# EasyEDA schematic SCH_G-Cacher_2026-07-06.json
TITLE: G-Cacher Esp32S3; REV: 0; Date: 2026-07-07; Sheet: 1/1; Drawn By: Niki Mardari; Company: ME
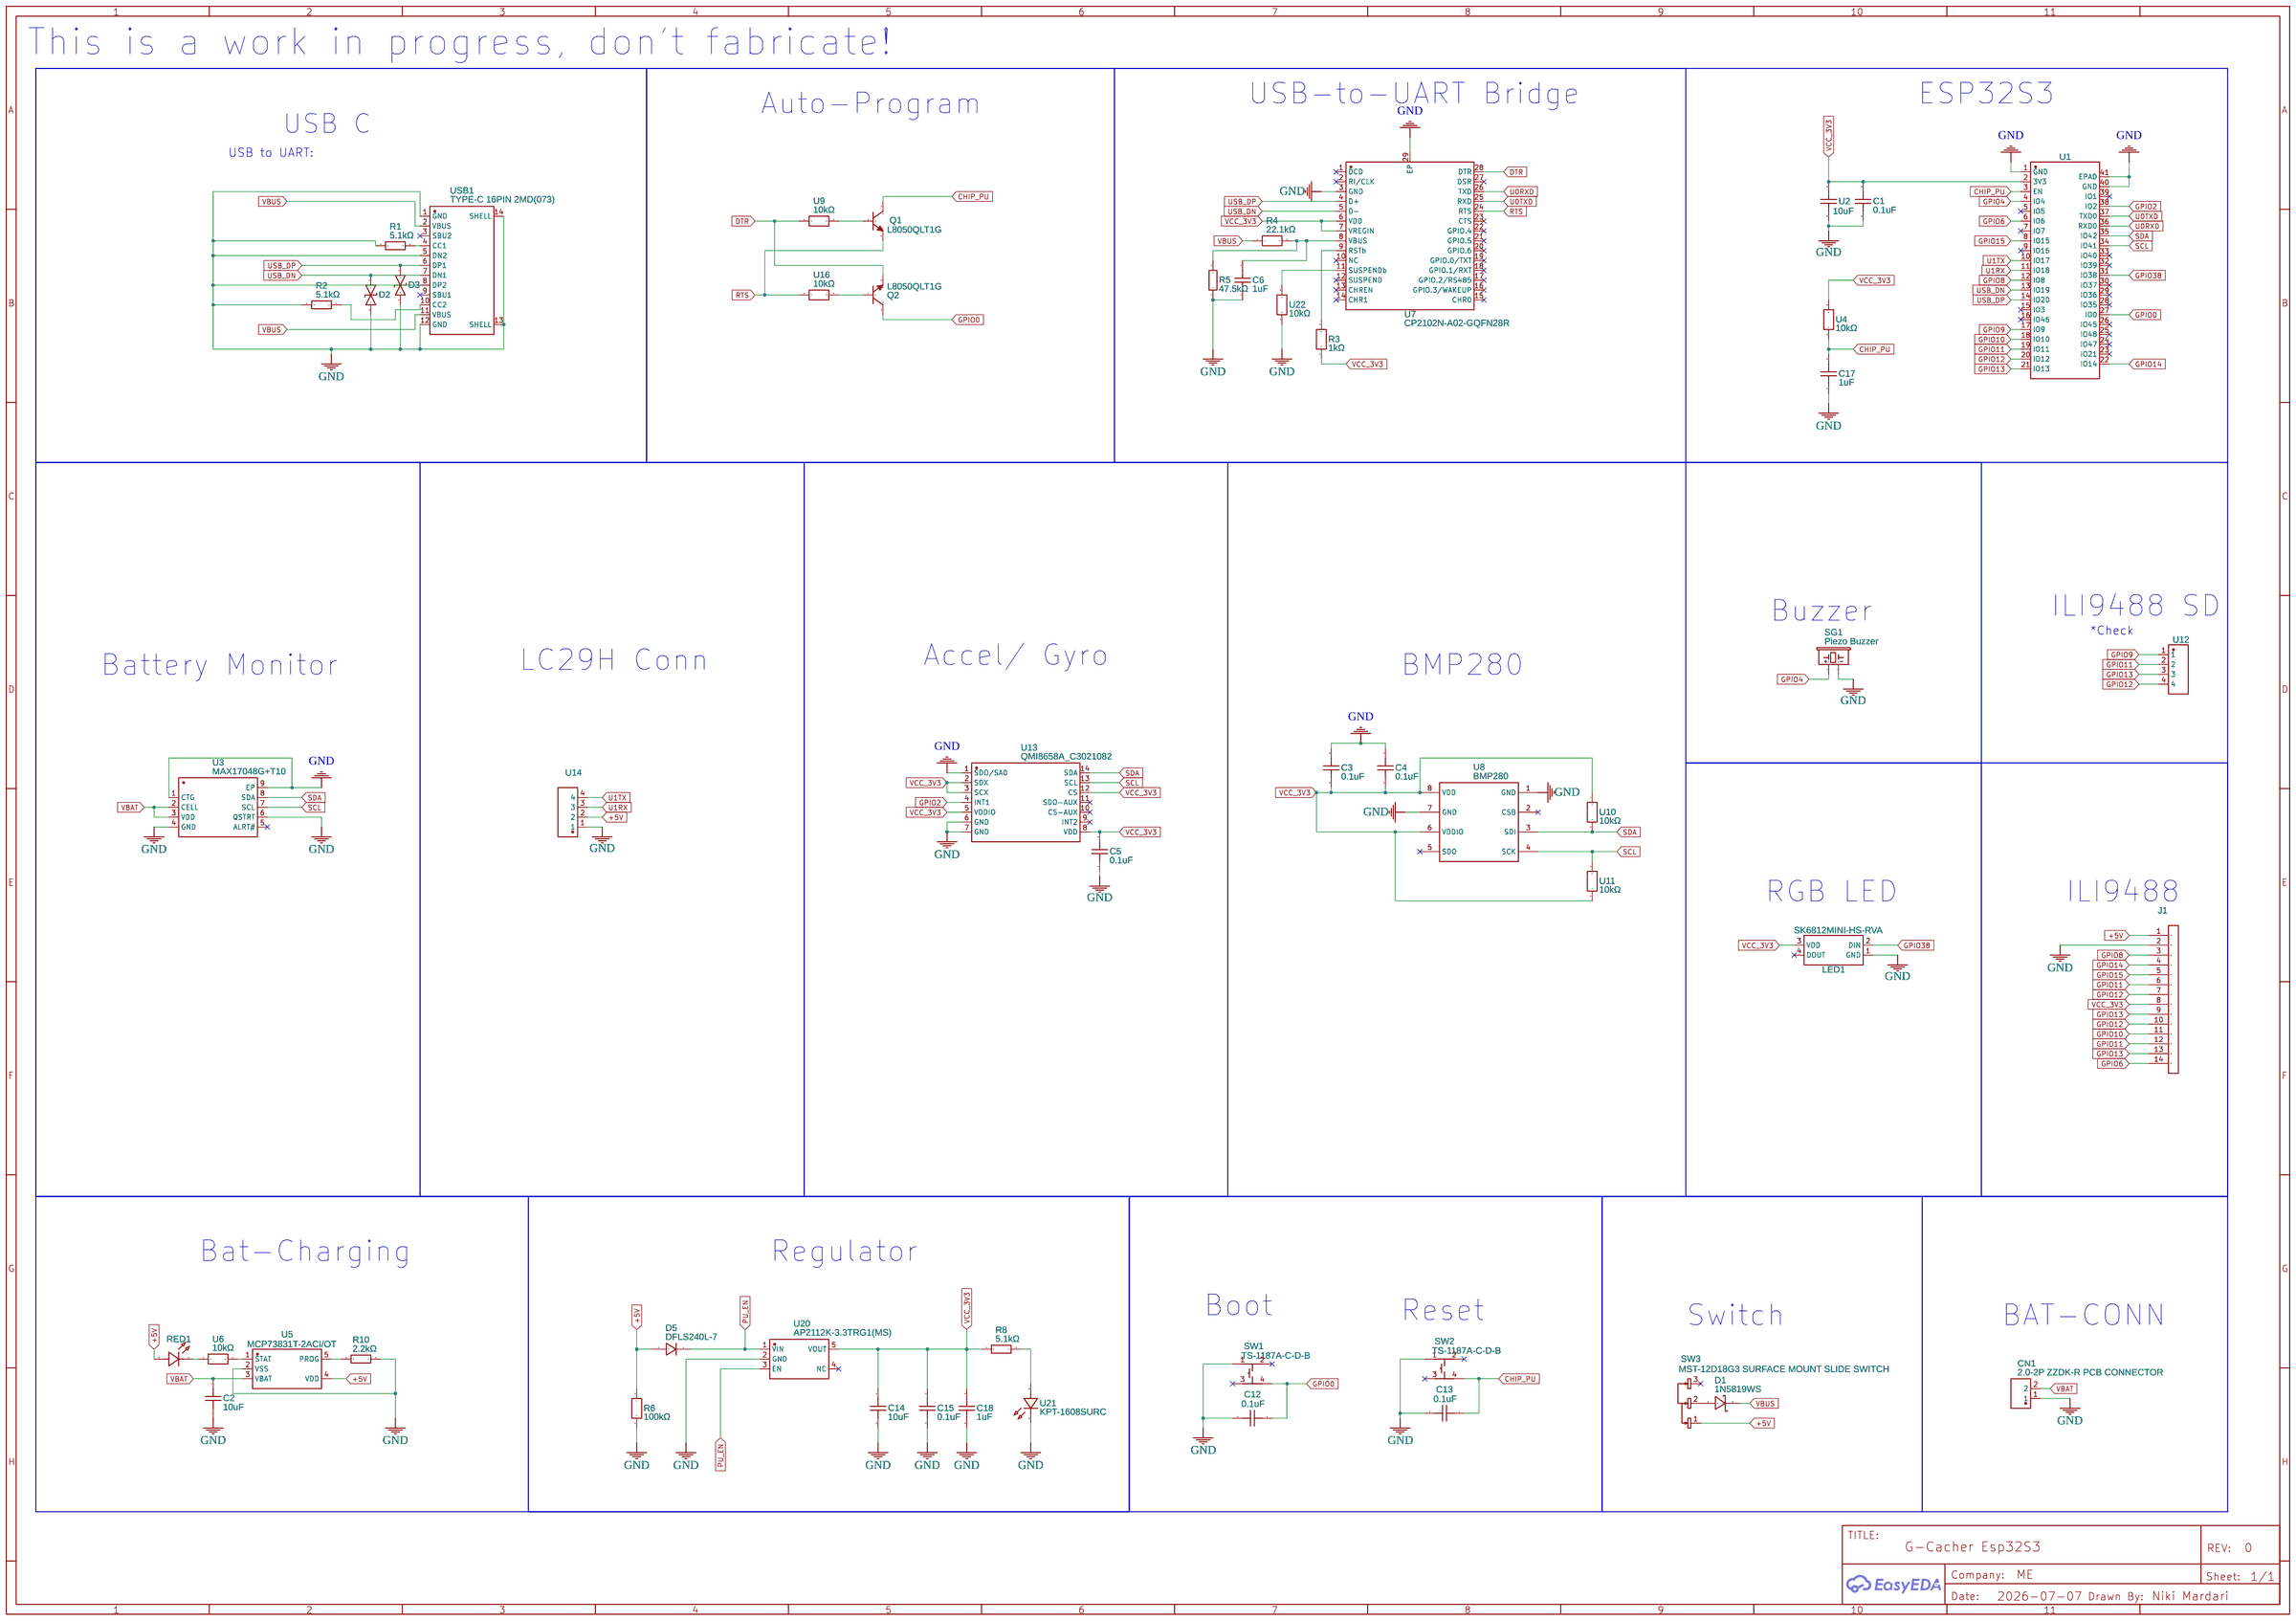
[diagram p0: schematic sheet]

## Parts
C1  0.1uF  [C0402]
C2  10uF  [C0603]
C3  0.1uF  [C0402]
C4  0.1uF  [C0402]
C5  0.1uF  [C0402]
C6  1uF  [CAP-SMD-L1.6-W0.8]
C12  0.1uF  [C0402]
C13  0.1uF  [C0402]
C14  10uF  [C0603]
C15  0.1uF  [C0402]
C17  1uF  [CAP-SMD-L1.6-W0.8]
C18  1uF  [CAP-SMD-L1.6-W0.8]
CN1  2.0-2P ZZDK-R PCB CONNECTOR  [CONN-TH_2.0-2P-ZZDK-R-PCB-CONNECTOR]
D1  1N5819WS  [SOD-323_L1.8-W1.3-LS2.5-RD]
D2  LESD5D5.0CT1G  [SOD-523_L1.2-W0.8-LS1.6-BI]
D3  LESD5D5.0CT1G  [SOD-523_L1.2-W0.8-LS1.6-BI]
D5  DFLS240L-7  [POWERDI-123_L2.8-W1.8-LS3.7-RD]
J1  14 PIN FEMALE HEADER  [14 PIN HEADER]
LED1  SK6812MINI-HS-RVA  [LED-SMD_4P-L3.5-W3.5_SK6812MINI-HS-RVA]
Q1  L8050QLT1G  [SOT-23-3_L2.9-W1.3-P1.90-LS2.4-BR]
Q2  L8050QLT1G  [SOT-23-3_L2.9-W1.3-P1.90-LS2.4-BR]
R1  5.1kΩ  [R0402]
R2  5.1kΩ  [R0402]
R3  1kΩ  [R0603]
R4  22.1kΩ  [R0402]
R5  47.5kΩ  [R0402]
R6  100kΩ  [R0603]
R8  5.1kΩ  [R0402]
R10  2.2kΩ  [R0402]
RED1  F.0603.00008/P2-0603R1TS2-06T-002  [LED0603_RED]
SG1  Piezo Buzzer  [BUZZER-12MM]
SW1  TS-1187A-C-D-B  [SW-SMD_4P-L5.1-W5.1-P3.70-LS6.5-TL_H2.0]
SW2  TS-1187A-C-D-B  [SW-SMD_4P-L5.1-W5.1-P3.70-LS6.5-TL_H2.0]
SW3  MST-12D18G3 SURFACE MOUNT SLIDE SWITCH  [SW-SMD_MST-12D18G4-SPDT-SLIDE-SWITCH]
U1  ESPS3-32-WROOM-1-N16R8  [WIRELM-SMD_ESP32-S3-WROOM-1]
U2  10uF  [C0603]
U3  MAX17048G+T10  [TDFN-8_L2.0-W2.0-P0.50-BL-EP1.2]
U4  10kΩ  [R0402]
U5  MCP73831T-2ACI/OT  [SOT-23-5_L3.0-W1.7-P0.95-LS2.8-BL]
U6  10kΩ  [R0603]
U7  CP2102N-A02-GQFN28R  [QFN-28_L5.0-W5.0-P0.50-TL-EP3.3]
U8  BMP280  [LGA-8_L2.5-W2.0-P0.65_AMP6127]
U9  10kΩ  [R0603]
U10  10kΩ  [R0603]
U11  10kΩ  [R0603]
U12  SSW-104-01-T-S  [HDR-TH_4P-P2.54-V-F]
U13  QMI8658A_C3021082  [LGA-14_L3.0-W2.5-P0.50-TL]
U14  SSW-104-01-T-S  [HDR-TH_4P-P2.54-V-F]
U16  10kΩ  [R0603]
U20  AP2112K-3.3TRG1(MS)  [SOT-23-5_L2.9-W1.6-P0.95-LS2.7-BR]
U21  KPT-1608SURC  [LED-SMD_L1.6-W0.8-RD-RED]
U22  10kΩ  [R0603]
USB1  TYPE-C 16PIN 2MD(073)  [USB-C-SMD_TYPE-C-6PIN-2MD-073]

## Library data of the parts
C1 C3-C5 C12 C13 C15 = C1005X5R1E104M050BC_C3886291: Contributor: lcsc; Supplier: LCSC; Supplier Part: C3886291; Manufacturer: TDK; Manufacturer Part: C1005X5R1E104M050BC; JLCPCB Part Class: Extended Part
C2 C14 = 0603X106M100NT: Supplier: LCSC; Manufacturer: FH(风华); Supplier Part: C91150; JLCPCB Part Class: Extended Part
C6 C17 C18 = YNA18B3U0G105MT000N: Supplier: LCSC; Supplier Part: C19542364; Manufacturer: TDK; JLCPCB Part Class: Extended Part; Contributor: lcsc
CN1 = 2.0-2P ZZDK-R PCB CONNECTOR: Supplier: LCSC; Supplier Part: C49023773; Manufacturer: SHOU HAN(首韩); Manufacturer Part: 2.0-2P ZZDK-R PCB Connector; JLCPCB Part Class: Extended Part; Contributor: lcsc
D1 = 1N5819WS: Contributor: qarnet; Supplier: LCSC; Supplier Part: C191023; Manufacturer: Hottech(合科泰); JLCPCB Part Class: Basic Part
D2 D3 = LESD5D5.0CT1G: Contributor: LCSC; Supplier: LCSC; Supplier Part: C383211; Manufacturer: LRC(乐山无线电); JLCPCB Part Class: Extended Part
D5 = DFLS240L-7: Contributor: LCSC; Supplier: LCSC; Supplier Part: C74179; Manufacturer: DIODES(美台); JLCPCB Part Class: Extended Part
J1 = 14 PIN FEMALE HEADER: Contributor: rnor; Package Display: No; JLCPCB Part Class: Extended Part
LED1 = SK6812MINI-HS-RVA: Supplier: LCSC; Supplier Part: C7423113; Manufacturer: 欧思科光电; JLCPCB Part Class: Extended Part; Contributor: lcsc
Q1 Q2 = L8050QLT1G: Supplier: LCSC; Manufacturer: LRC(乐山无线电); Supplier Part: C49581; JLCPCB Part Class: Extended Part
R1 R2 R8 = 0402WGF5101TCE: Supplier: LCSC; Manufacturer: UNI-ROYAL(厚声); Supplier Part: C25905; JLCPCB Part Class: Basic Part
R3 = PTFR0603Q1K00N9: Supplier: LCSC; Supplier Part: C23067434; Manufacturer: RESI(开步睿思); Contributor: lcsc; JLCPCB Part Class: Extended Part
R4 = FRC0402F2212TS: Supplier: LCSC; Supplier Part: C2929993; Manufacturer: FOJAN(富捷); JLCPCB Part Class: Extended Part; Contributor: lcsc
R5 = RC-02K4752FT: Contributor: LCSC; Supplier: LCSC; Supplier Part: C324818; Manufacturer: FH(风华); JLCPCB Part Class: Extended Part
R6 = TR0603B100KP0525Z: Supplier: LCSC; Supplier Part: C3202453; Manufacturer: EVER OHMS(天二科技); JLCPCB Part Class: Extended Part; Contributor: lcsc
R10 = RMC04022.2K5%N: Contributor: LCSC; Supplier: LCSC; Supplier Part: C269678; Manufacturer: Tyohm(幸亚电阻); JLCPCB Part Class: Extended Part
RED1 = F.0603.00008/P2-0603R1TS2-06T-002: Supplier: LCSC; Supplier Part: C7496810; Manufacturer: TUOZHAN(拓展光电); Contributor: lcsc; JLCPCB Part Class: Extended Part
SG1 = Piezo Buzzer: Contributor: SparkFun; sourceId: 0s1nhpZJj; Package Display: No; JLCPCB Part Class: Extended Part
SW1 SW2 = TS-1187A-C-D-B: Contributor: LCSC; Supplier: LCSC; Supplier Part: C318888; Manufacturer: XKB Connection(中国星坤); JLCPCB Part Class: Extended Part
SW3 = MST-12D18G3 SURFACE MOUNT SLIDE SWITCH: Supplier: LCSC; Supplier Part: C49023766; Manufacturer: SHOU HAN(首韩); Manufacturer Part: MST-12D18G3 Surface Mount Slide Switch; JLCPCB Part Class: Extended Part; Contributor: lcsc
U1 = ESPS3-32-WROOM-1-N16R8: Supplier: LCSC; Supplier Part: C9900209626; Manufacturer: null; JLCPCB Part Class: Extended Part; Contributor: lcsc
U2 = HGC0603R5106K250NTHJ: Supplier: LCSC; Supplier Part: C22367825; Manufacturer: Chinocera(华瓷); JLCPCB Part Class: Extended Part; Contributor: lcsc
U3 = MAX17048G+T10: Contributor: LCSC; Supplier: LCSC; Supplier Part: C2682616; Manufacturer: ADI(亚德诺)/MAXIM(美信); JLCPCB Part Class: Extended Part
U4 = THC02H1002BT: Contributor: lcsc; Supplier: LCSC; Supplier Part: C2991528; Manufacturer: FH(风华); JLCPCB Part Class: Extended Part
U5 = MCP73831T-2ACI/OT: Contributor: LCSC; Supplier: LCSC; Supplier Part: C424093; Manufacturer: MICROCHIP(美国微芯); JLCPCB Part Class: Extended Part
U6 U9-U11 U16 U22 = CRGH0603F10K: Supplier: LCSC; Supplier Part: C2098347; Manufacturer: TE Connectivity(泰科电子); JLCPCB Part Class: Extended Part; Contributor: lcsc
U7 = CP2102N-A02-GQFN28R: Contributor: LCSC; Supplier: LCSC; Supplier Part: C964632; Manufacturer: SKYWORKS/SILICON LABS(芯科); JLCPCB Part Class: Extended Part
U8 = BMP280: Supplier: LCSC; Manufacturer: Bosch(博世); Supplier Part: C83291; JLCPCB Part Class: Extended Part
U12 U14 = SSW-104-01-T-S: Supplier: LCSC; Supplier Part: C3323964; Manufacturer: SAMTEC; JLCPCB Part Class: Extended Part; Contributor: lcsc; Package Display: No
U13 = QMI8658A_C3021082: Contributor: lcsc; Supplier: LCSC; Supplier Part: C3021082; Manufacturer: QST(上海矽睿); Manufacturer Part: QMI8658A; JLCPCB Part Class: Extended Part
U20 = AP2112K-3.3TRG1(MS): Supplier: LCSC; Supplier Part: C22365427; Manufacturer: MSKSEMI(美森科); JLCPCB Part Class: Extended Part; Contributor: lcsc
U21 = KPT-1608SURC: Supplier: LCSC; Supplier Part: C5878871; Manufacturer: Kingbright; Contributor: lcsc; JLCPCB Part Class: Extended Part
USB1 = TYPE-C 16PIN 2MD(073): Contributor: LCSC; Supplier: LCSC; Supplier Part: C2765186; Manufacturer: SHOU HAN(首韩); JLCPCB Part Class: Extended Part

## Nets
+5V: D5.2 J1.1 R6.2 RED1.1(+) SW3.1 U5.4(VDD) U14.2
GND: C1.1 C2.1 C3.2 C4.2 C5.1 C6.1 C12.2 C13.2 C14.1 C15.1 C17.1 C18.1 CN1.1 D2.2 D3.2 J1.2 LED1.1(GND) R1.1 R2.1 R5.1 R6.1 R10.1 SG1.-(2) SW1.1(A) SW2.1(A) U1.1(GND) U1.40(GND) U1.41(EPAD) U2.1 U3.1(CTG) U3.4(GND) U3.6(QSTRT) U3.9(EP) U5.2(VSS) U7.3(GND) U7.29(EP) U8.1(GND) U8.7(GND) U13.1(SDO/SA0) U13.6(GND) U13.7(GND) U14.1 U20.2(GND) U21.1(K) U22.1 USB1.1(GND) USB1.5(DN2) USB1.8(DP2) USB1.12(GND) USB1.13(SHELL) USB1.14(SHELL)
VBAT: C2.2 CN1.2 U3.2(CELL) U3.3(VDD) U5.3(VBAT)
VBUS: D1.1(K) R4.1 USB1.2(VBUS) USB1.11(VBUS)
VCC_3V3: C1.2 C3.1 C4.1 C5.2 C14.2 C15.2 C18.2 J1.8 LED1.3(VDD) R3.1 R8.1 U1.2(3V3) U2.2 U4.2 U7.6(VDD) U7.7(VREGIN) U8.6(VDDIO) U8.8(VDD) U10.1 U11.1 U13.2(SDX) U13.3(SCX) U13.5(VDDIO) U13.8(VDD) U13.12(CS) U20.5(VOUT)
CHIP_PU: C13.1 C17.2 Q1.3(C) SW2.4(D) U1.3(EN) U4.1
DTR: Q2.2(E) U7.28(DTR) U9.1
GPIO0: C12.1 Q2.3(C) SW1.4(D) U1.27(IO0)
GPIO2: U1.38(IO2) U13.4(INT1)
GPIO4: SG1.+(1) U1.4(IO4)
GPIO6: J1.14 U1.6(IO6)
GPIO8: J1.3 U1.12(IO8)
GPIO9: U1.17(IO9) U12.1
GPIO10: J1.11 U1.18(IO10)
GPIO11: J1.6 J1.12 U1.19(IO11) U12.2
GPIO12: J1.7 J1.10 U1.20(IO12) U12.4
GPIO13: J1.9 J1.13 U1.21(IO13) U12.3
GPIO14: J1.4 U1.22(IO14)
GPIO15: J1.5 U1.8(IO15)
GPIO38: LED1.2(DIN) U1.31(IO38)
PU_EN: D5.1 U20.1(VIN) U20.3(EN)
RTS: Q1.2(E) U7.24(RTS) U16.1
SCL: U1.34(IO41) U3.7(SCL) U8.4(SCK) U11.2 U13.13(SCL)
SDA: U1.35(IO42) U3.8(SDA) U8.3(SDI) U10.2 U13.14(SDA)
U0RXD: U1.36(RXD0) U7.26(TXD)
U0TXD: U1.37(TXD0) U7.25(RXD)
U1RX: U1.11(IO18) U14.3
U1TX: U1.10(IO17) U14.4
USB_DN: D2.1 U1.13(IO19) U7.5(D-) USB1.7(DN1)
USB_DP: D3.1 U1.14(IO20) U7.4(D+) USB1.6(DP1)
Net-(C6-2): C6.2 R4.2 R5.2 U7.8(VBUS)
Net-(D1-2): D1.2(A) SW3.2
Net-(Q1-1): Q1.1(B) U9.2
Net-(Q2-1): Q2.1(B) U16.2
Net-(R1-2): R1.2 USB1.4(CC1)
Net-(R2-2): R2.2 USB1.10(CC2)
Net-(R3-2): R3.2 U7.9(RSTb)
Net-(R8-2): R8.2 U21.2(A)
Net-(R10-2): R10.2 U5.5(PROG)
Net-(RED1-2): RED1.2(-) U6.2
Net-(U5-1): U5.1(STAT) U6.1
Net-(U7-11): U7.11(SUSPENDb) U22.2

Not connected (* = marked no-connect by the designer): LED1 4(DOUT)*; SW1 2(B)* 3(C)*; SW2 2(B)* 3(C)*; SW3 3*; U1 5(IO5)* 7(IO7)* 9(IO16)* 15(IO3)* 16(IO46)* 23(IO21)* 24(IO47)* 25(IO48)* 26(IO45)* 28(IO35)* 29(IO36)* 30(IO37)* 32(IO39)* 33(IO40)* 39(IO1)*; U3 5(ALRT#)*; U7 1(DCD)* 2(RI/CLK)* 10(NC)* 12(SUSPEND)* 13(CHREN)* 14(CHR1)* 15(CHR0)* 16(GPIO.3/WAKEUP)* 17(GPIO.2/RS485)* 18(GPIO.1/RXT)* 19(GPIO.0/TXT)* 20(GPIO.6)* 21(GPIO.5)* 22(GPIO.4)* 23(CTS)* 27(DSR)*; U8 2(CSB)* 5(SDO)*; U13 9(INT2)* 10(CS-AUX)* 11(SDO-AUX)*; U20 4(NC)*; USB1 3(SBU2)* 9(SBU1)*

## Notes on the sheet
- This is a work in progress, don't fabricate!
- USB-to-UART Bridge
- ESP32S3
- Auto-Program
- USB C
- USB to UART:
- Buzzer
- ILI9488 SD
- *Check
- LC29H Conn
- Accel/ Gyro
- Battery Monitor
- BMP280
- RGB LED
- ILI9488
- Bat-Charging
- Regulator
- Boot
- Reset
- Switch
- BAT-CONN
